# EAGLE design konverter (EAGLE 6.3)
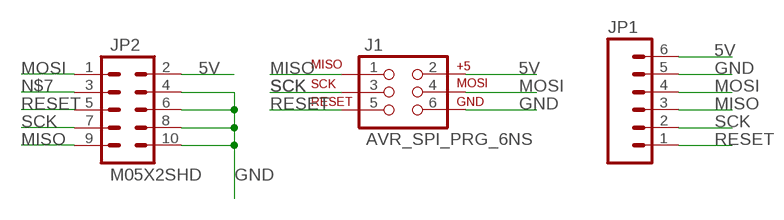
[diagram p0: schematic, sheet 1]

## Parts
J1  AVR_SPI_PRG_6NS  [2X3-NS]
JP1  M06LONGPADS  [1X06_LONGPADS]
JP2  M05X2SHD  [2X5-SHROUDED]

## Nets
5V: J1.2 JP1.6 JP2.2
GND: J1.6 JP1.5 JP2.4 JP2.6 JP2.8 JP2.10
MISO: J1.1 JP1.3 JP2.9
MOSI: J1.4 JP1.4 JP2.1
N$7: JP2.3
RESET: J1.5 JP1.1 JP2.5
SCK: J1.3 JP1.2 JP2.7

## Library data of the parts
J1 = SparkFun-Connectors:AVR_SPI_PRG_6: AVR ISP 6 Pin This is the reduced ISP connector for AVR programming. Common on Arduino. This footprint will take up less PCB space and can be used with a 10-pin to 6-pin adapter such as SKU: BOB-08508
JP1 = SparkFun-Connectors:M06: Header 6 Standard 6-pin 0.1" header. Use with straight break away headers (SKU : PRT-00116), right angle break away headers (PRT-00553), swiss pins (PRT-00743), machine pins (PRT-00117), and female headers (PRT-00115). Molex polarized connector foot print use with SKU : PRT-08094 with associated crimp pins and housings. NOTES ON THE VARIANTS LOCK and LOCK_LONGPADS... This footprint was designed to help hold the alignment of a through-hole component (i.e. 6-pin header) while soldering it into place. You may notice that each hole has been shifted either up or down by 0.005 of an inch from it's more standard position (which is a perfectly straight line). This slight alteration caused the pins (the squares in the middle) to touch the edges of the holes. Because they are alternating, it causes a "brace" to hold the component in place. 0.005 has proven to be the perfect amount of "off-center" position when using our standard breakaway headers. Although looks a little odd when you look at the bare footprint, once you have a header in there, the alteration is very hard to notice. Also, if you push a header all the way into place, it is covered up entirely on the bottom side. This idea of altering the position of holes to aid alignment will be further integrated into the Sparkfun Library for other footprints. It can help hold any component with 3 or more connection pins.
JP2 = SparkFun-Connectors:M05X2: Header 5x2 Standard 10-pin dual row 0.1" header. Commonly used with AVR-ISP. Use with Spark Fun Electronics SKU: PRT-00778

## Board
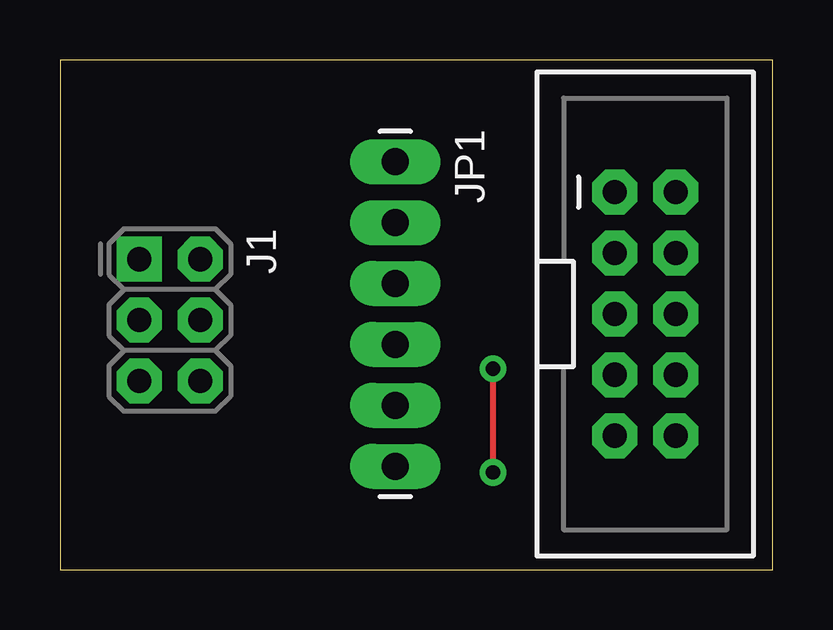
[diagram p1: board, top side]
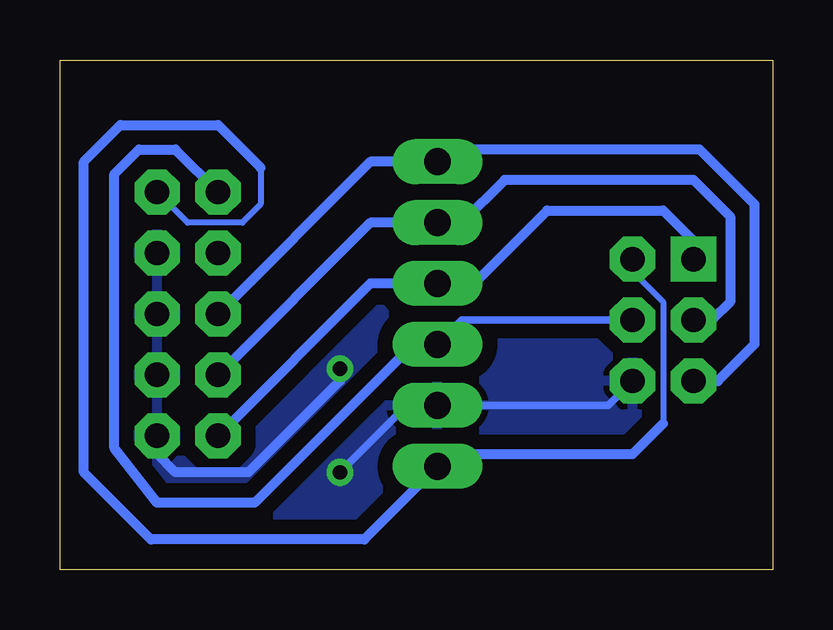
[diagram p2: board, bottom side, seen from below]

Size 29.7 x 21.26 mm. Coordinates in mm from the lower left corner, seen from the top.
Outline: 0,0 29.7,0 29.7,21.26 0,21.26 0,0
Copper layers (1*16): Top 0.035mm / dielectric 1.5mm / Bottom 0.035mm
Design rules "SparkFun": minimum track width 8mil, minimum drill 20mil, track to track 8mil, track to pad 8mil, pad to pad 8mil, via to via 8mil, smd to smd 8mil, copper to edge 10mil, drill to drill 8mil, minimum pad ring 12mil, minimum via ring 10mil, stop-mask expansion 4mil, vias tented up to drill 25mil, thermal gap 10mil

### Footprints (pad centres in the part's own frame; a part is rotated, then mirrored left to right if it is on the bottom)
2X3-NS = drill 1.016 pad 1.88 square: 1 -2.54,-1.27 | drill 1.016 pad 1.88 octagon: 2 -2.54,1.27; 3 0,-1.27; 4 0,1.27; 5 2.54,-1.27; 6 2.54,1.27
1X06_LONGPADS = drill 1.118 pad 1.88 long: 1 0,0; 2 2.54,0; 3 5.08,0; 4 7.62,0; 5 10.16,0; 6 12.7,0
2X5-SHROUDED = drill 1.016 pad 1.88 octagon: 1 -1.27,5.08; 2 1.27,5.08; 3 -1.27,2.54; 4 1.27,2.54; 5 -1.27,0; 6 1.27,0; 7 -1.27,-2.54; 8 1.27,-2.54; 9 -1.27,-5.08; 10 1.27,-5.08

### Placement (x,y rotation side)
J1  4.57,10.41 270 top
JP1  13.97,17.02 270 top
JP2  24.38,10.67 0 top

### Tracks (layer width: path | path; a pad name or v marks a point on that pad's centre or on a via)
5V
  Bottom 0.254: 4.57,6.1 4.57,11.18 5.84,12.45 J1.2 | 13.46,4.83 JP1.6 | 21.34,16.76 21.34,15.24 22.1,14.48 24.38,14.48 JP2.2
  Bottom 0.406: JP1.6 17.02,1.27 25.91,1.27 28.7,4.06 28.7,17.02 27.18,18.54 23.11,18.54 21.34,16.76 | 13.46,4.83 5.84,4.83 4.57,6.1
GND  (via drill 0.6)
  Top 0.254: v18.03,8.38 v18.03,4.06
  Bottom 0.305: v18.03,4.06 15.24,6.86 JP1.5 6.86,6.86 J1.6
  Bottom 0.406: v18.03,8.38 18.03,7.87 21.84,4.06 24.89,4.06 25.65,4.83 JP2.10
  pour Bottom (isolate 0.61): 0.25,0.51 29.21,0.51 29.21,20.57 0.25,20.57
MISO
  Bottom 0.406: JP2.9 16.76,11.94 JP1.3 12.45,11.94 9.4,14.99 4.57,14.99 3.3,13.72 J1.1
MOSI
  Bottom 0.305: J1.4 12.95,10.41 JP1.4
  Bottom 0.406: JP1.4 14.99,9.4 21.59,2.79 25.65,2.79 27.43,5.08 27.43,16.51 26.42,17.53 24.89,17.53 JP2.1
RESET
  Bottom 0.406: JP2.5 16.76,17.02 JP1.1 13.46,17.53 3.05,17.53 0.76,15.24 0.76,9.4 2.29,7.87 J1.5
SCK
  Bottom 0.406: JP2.7 16.76,14.48 JP1.2 12.95,14.48 11.18,16.26 3.3,16.26 1.78,14.73 1.78,11.18 2.54,10.41 J1.3